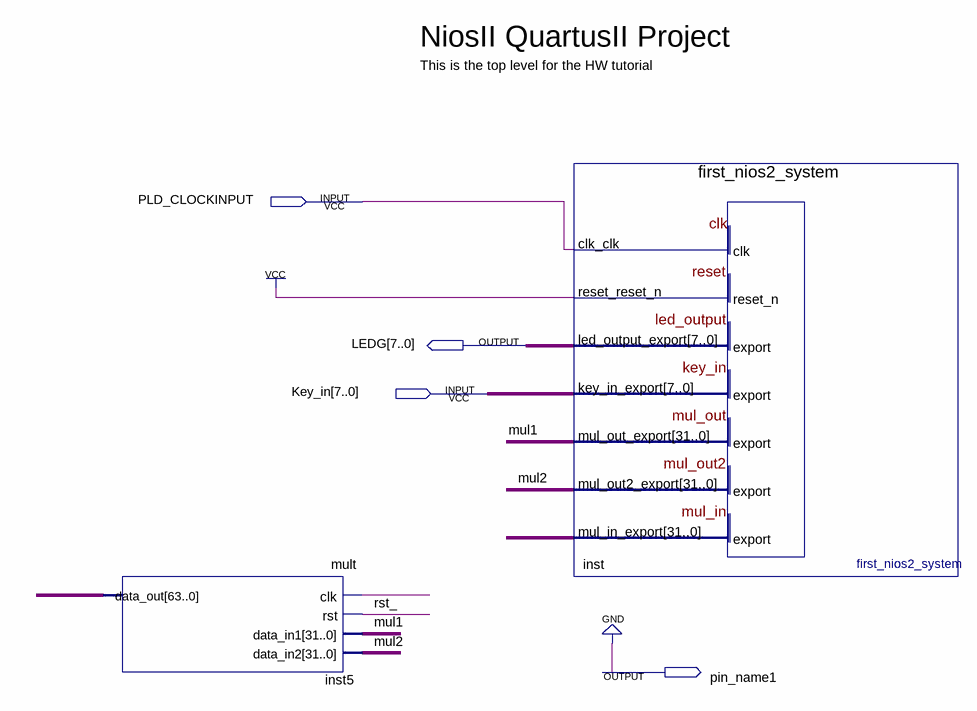
[diagram p0: schematic sheet]
// Quartus schematic nios2_quartus2_project.bdf as structural Verilog: 2 symbols, 4 pins
module nios2_quartus2_project (
  input  PLD_CLOCKINPUT,
  input  [7:0] Key_in,
  output [7:0] LEDG,
  output pin_name1
);

  wire mul1, mul2, mul3;

  mult inst5 (.clk(PLD_CLOCKINPUT), .rst(1'b1), .data_in1({32{mul1}}), .data_in2({32{mul2}}), .data_out(mul3));
  first_nios2_system inst (
    .clk_clk(PLD_CLOCKINPUT), .reset_reset_n(1'b1), .key_in_export(Key_in), .mul_in_export({32{mul3}}),
    .led_output_export(LEDG), .mul_out_export(mul1), .mul_out2_export(mul2));

  assign pin_name1 = 1'b0;

  // Other names for the same wires on the sheet: clk_ = PLD_CLOCKINPUT

  // Notes on the sheet:
  //   NiosII QuartusII Project
  //   This is the top level for the HW tutorial
endmodule
